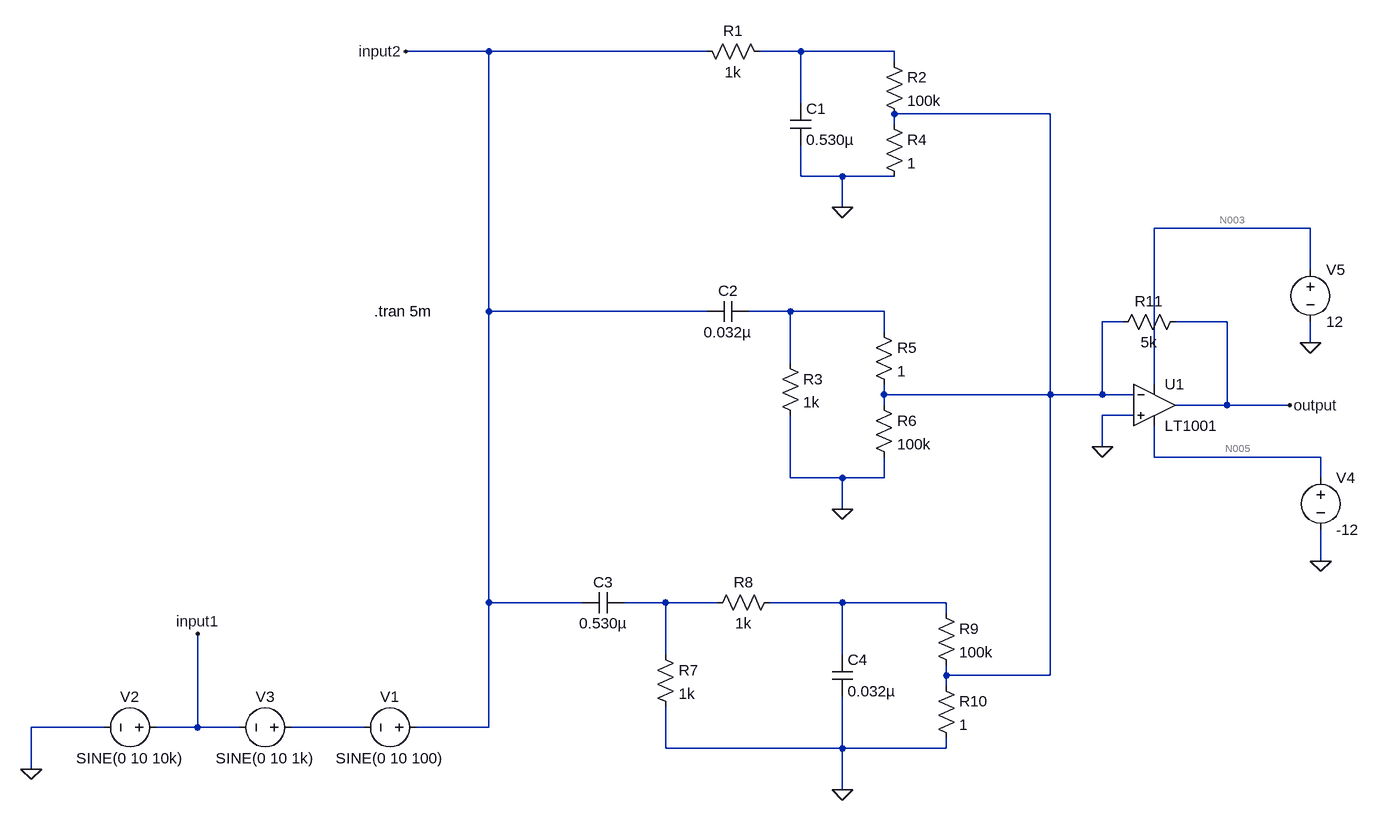
[diagram p0: schematic 3-phase-equalizer-high-pass.asc]
3-phase-equalizer-high-pass.asc, the LTspice schematic file:
Version 4
SHEET 1 2136 1332
WIRE 0 16 -128 16
WIRE 336 16 0 16
WIRE 480 16 416 16
WIRE 624 16 480 16
WIRE 624 32 624 16
WIRE 480 96 480 16
WIRE 864 112 624 112
WIRE 624 128 624 112
WIRE 480 208 480 160
WIRE 544 208 480 208
WIRE 624 208 544 208
WIRE 544 256 544 208
WIRE 1264 288 1024 288
WIRE 1264 352 1264 288
WIRE 0 416 0 16
WIRE 336 416 0 416
WIRE 464 416 400 416
WIRE 608 416 464 416
WIRE 976 432 944 432
WIRE 1136 432 1056 432
WIRE 608 448 608 416
WIRE 1264 464 1264 432
WIRE 464 496 464 416
WIRE 1024 528 1024 288
WIRE 608 544 608 528
WIRE 864 544 864 112
WIRE 864 544 608 544
WIRE 944 544 944 432
WIRE 944 544 864 544
WIRE 992 544 944 544
WIRE 608 560 608 544
WIRE 1136 560 1136 432
WIRE 1136 560 1056 560
WIRE 1232 560 1136 560
WIRE 992 576 944 576
WIRE 944 624 944 576
WIRE 1024 640 1024 592
WIRE 1280 640 1024 640
WIRE 464 672 464 576
WIRE 544 672 464 672
WIRE 608 672 608 640
WIRE 608 672 544 672
WIRE 1280 672 1280 640
WIRE 544 720 544 672
WIRE 1280 800 1280 752
WIRE 0 864 0 416
WIRE 144 864 0 864
WIRE 272 864 208 864
WIRE 352 864 272 864
WIRE 544 864 432 864
WIRE 704 864 544 864
WIRE 704 880 704 864
WIRE 272 944 272 864
WIRE 544 944 544 864
WIRE 704 976 704 960
WIRE 864 976 864 544
WIRE 864 976 704 976
WIRE 704 992 704 976
WIRE -592 1056 -704 1056
WIRE -448 1056 -448 912
WIRE -448 1056 -512 1056
WIRE -384 1056 -448 1056
WIRE -192 1056 -304 1056
WIRE 0 1056 0 864
WIRE 0 1056 -112 1056
WIRE 272 1088 272 1024
WIRE 544 1088 544 1008
WIRE 544 1088 272 1088
WIRE 704 1088 704 1072
WIRE 704 1088 544 1088
WIRE -704 1120 -704 1056
WIRE 544 1152 544 1088
FLAG 544 256 0
FLAG 544 720 0
FLAG 544 1152 0
FLAG -128 16 input2
FLAG -704 1120 0
FLAG 944 624 0
FLAG 1232 560 output
FLAG 1264 464 0
FLAG 1280 800 0
FLAG -448 912 input1
SYMBOL res 320 0 M90
WINDOW 0 0 56 VBottom 2
WINDOW 3 32 56 VTop 2
SYMATTR InstName R1
SYMATTR Value 1k
SYMBOL cap 464 96 R0
SYMATTR InstName C1
SYMATTR Value 0.530µ
SYMBOL cap 400 400 R90
WINDOW 0 0 32 VBottom 2
WINDOW 3 32 32 VTop 2
SYMATTR InstName C2
SYMATTR Value 0.032µ
SYMBOL res 448 480 R0
SYMATTR InstName R3
SYMATTR Value 1k
SYMBOL res 608 16 R0
SYMATTR InstName R2
SYMATTR Value 100k
SYMBOL res 608 112 R0
SYMATTR InstName R4
SYMATTR Value 1
SYMBOL res 592 432 R0
SYMATTR InstName R5
SYMATTR Value 1
SYMBOL res 592 544 R0
SYMATTR InstName R6
SYMATTR Value 100k
SYMBOL cap 208 848 R90
WINDOW 0 0 32 VBottom 2
WINDOW 3 32 32 VTop 2
SYMATTR InstName C3
SYMATTR Value 0.530µ
SYMBOL res 256 928 R0
SYMATTR InstName R7
SYMATTR Value 1k
SYMBOL res 448 848 R90
WINDOW 0 0 56 VBottom 2
WINDOW 3 32 56 VTop 2
SYMATTR InstName R8
SYMATTR Value 1k
SYMBOL cap 528 944 R0
SYMATTR InstName C4
SYMATTR Value 0.032µ
SYMBOL res 688 864 R0
SYMATTR InstName R9
SYMATTR Value 100k
SYMBOL res 688 976 R0
SYMATTR InstName R10
SYMATTR Value 1
SYMBOL voltage -96 1056 R90
WINDOW 0 -32 56 VBottom 2
WINDOW 3 32 56 VTop 2
WINDOW 123 0 0 Left 0
WINDOW 39 0 0 Left 0
SYMATTR InstName V1
SYMATTR Value SINE(0 10 100)
SYMBOL voltage -496 1056 R90
WINDOW 0 -32 56 VBottom 2
WINDOW 3 32 56 VTop 2
WINDOW 123 0 0 Left 0
WINDOW 39 0 0 Left 0
SYMATTR InstName V2
SYMATTR Value SINE(0 10 10k)
SYMBOL voltage -288 1056 R90
WINDOW 0 -32 56 VBottom 2
WINDOW 3 32 56 VTop 2
WINDOW 123 0 0 Left 0
WINDOW 39 0 0 Left 0
SYMATTR InstName V3
SYMATTR Value SINE(0 10 1k)
SYMBOL OpAmps\\LT1001 1024 496 R0
SYMATTR InstName U1
SYMBOL res 1072 416 R90
WINDOW 0 0 56 VBottom 2
WINDOW 3 32 56 VTop 2
SYMATTR InstName R11
SYMATTR Value 5k
SYMBOL voltage 1280 656 R0
WINDOW 123 0 0 Left 0
WINDOW 39 0 0 Left 0
SYMATTR InstName V4
SYMATTR Value -12
SYMBOL voltage 1264 336 R0
WINDOW 123 0 0 Left 0
WINDOW 39 0 0 Left 0
SYMATTR InstName V5
SYMATTR Value 12
TEXT -176 416 Left 2 !.tran 5m

The netlist it stands for:
* 3-phase-equalizer-high-pass.asc
R1 input2 N001 1k
C1 N001 0 0.530µ
C2 N004 input2 0.032µ
R3 N004 0 1k
R2 N001 N002 100k
R4 N002 0 1
R5 N004 N002 1
R6 N002 0 100k
C3 N006 input2 0.530µ
R7 N006 0 1k
R8 N007 N006 1k
C4 N007 0 0.032µ
R9 N007 N002 100k
R10 N002 0 1
V1 input2 N008 SINE(0 10 100)
V2 input1 0 SINE(0 10 10k)
V3 N008 input1 SINE(0 10 1k)
XU1 0 N002 N003 N005 output LT1001  ; pins In+ In- V+ V- OUT
R11 output N002 5k
V4 N005 0 -12
V5 N003 0 12
.tran 5m
.lib LTC.lib
.backanno
.end

* Results of the author's LTspice run, read from the files saved beside the schematic
* Operating Point, zero values left out:
*   V(n003) = 12 V
*   V(n005) = -12 V
*   I(V5) = -2.25 mA
*   I(V4) = 2.25 mA
*   Ix(u1:3) = 2.25 mA
*   Ix(u1:4) = -2.25 mA
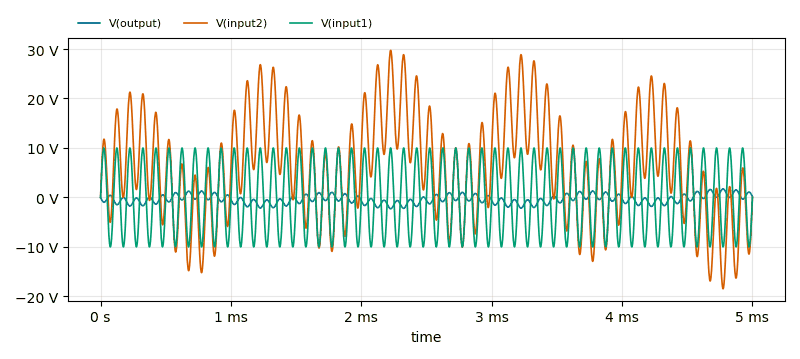
[diagram p1: Transient Analysis of 3-phase-equalizer-high-pass.asc, plotted from the saved traces]
* Transient Analysis, 1 run:
*   V(output): min -2.298 V, max 1.725 V, average -369 mV, rms 939.4 mV, last 156 mV
*   V(input2): min -18.46 V, max 29.73 V, average 6.366 V, rms 12.26 V, last 0 V
*   V(input1): min -10 V, max 10 V, average -108.1 µV, rms 7.09 V, last 0 V